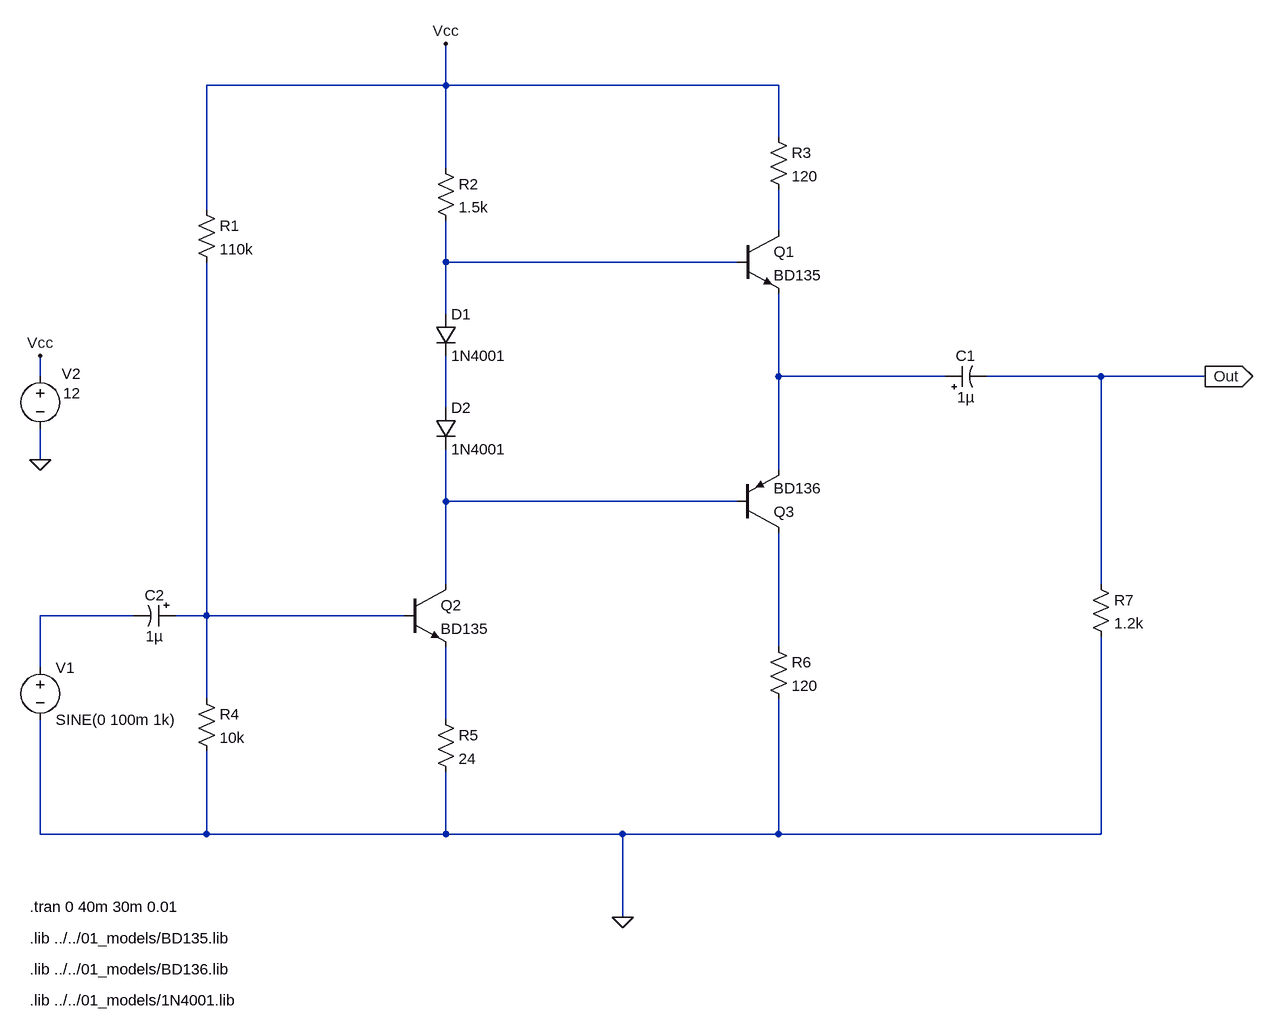
[diagram p0: schematic powamp_06_02_03_class_ab.asc]
powamp_06_02_03_class_ab.asc, the LTspice schematic file:
Version 4
SHEET 1 1580 1208
WIRE 288 -288 288 -352
WIRE 288 -288 -80 -288
WIRE 800 -288 288 -288
WIRE 800 -208 800 -288
WIRE 288 -160 288 -288
WIRE -80 -96 -80 -288
WIRE 800 -64 800 -128
WIRE 288 -16 288 -80
WIRE 736 -16 288 -16
WIRE 288 64 288 -16
WIRE -336 160 -336 128
WIRE 800 160 800 32
WIRE 1056 160 800 160
WIRE 1296 160 1120 160
WIRE 1456 160 1296 160
WIRE 288 208 288 128
WIRE -336 288 -336 240
WIRE 800 304 800 160
WIRE 288 352 288 272
WIRE 736 352 288 352
WIRE 288 480 288 352
WIRE 1296 480 1296 160
WIRE -192 528 -336 528
WIRE -80 528 -80 -16
WIRE -80 528 -128 528
WIRE 224 528 -80 528
WIRE 800 576 800 400
WIRE -336 608 -336 528
WIRE -80 656 -80 528
WIRE 288 688 288 576
WIRE -336 864 -336 688
WIRE -80 864 -80 736
WIRE -80 864 -336 864
WIRE 288 864 288 768
WIRE 288 864 -80 864
WIRE 560 864 288 864
WIRE 800 864 800 656
WIRE 800 864 560 864
WIRE 1296 864 1296 560
WIRE 1296 864 800 864
WIRE 560 992 560 864
FLAG 560 992 0
FLAG 1456 160 Out
IOPIN 1456 160 Out
FLAG -336 288 0
FLAG -336 128 Vcc
FLAG 288 -352 Vcc
SYMBOL res -96 -112 R0
SYMATTR InstName R1
SYMATTR Value 110k
SYMBOL res 272 -176 R0
SYMATTR InstName R2
SYMATTR Value 1.5k
SYMBOL res 784 -224 R0
SYMATTR InstName R3
SYMATTR Value 120
SYMBOL res -96 640 R0
SYMATTR InstName R4
SYMATTR Value 10k
SYMBOL res 272 672 R0
SYMATTR InstName R5
SYMATTR Value 24
SYMBOL res 784 560 R0
SYMATTR InstName R6
SYMATTR Value 120
SYMBOL res 1280 464 R0
SYMATTR InstName R7
SYMATTR Value 1.2k
SYMBOL polcap 1056 176 R270
WINDOW 0 32 32 VTop 2
WINDOW 3 0 32 VBottom 2
SYMATTR InstName C1
SYMATTR Value 1µ
SYMBOL polcap -128 512 R90
WINDOW 0 0 32 VBottom 2
WINDOW 3 32 32 VTop 2
SYMATTR InstName C2
SYMATTR Value 1µ
SYMBOL voltage -336 592 R0
WINDOW 123 0 0 Left 2
WINDOW 39 0 0 Left 2
SYMATTR InstName V1
SYMATTR Value SINE(0 100m 1k)
SYMBOL voltage -336 144 R0
WINDOW 3 35 42 Left 2
WINDOW 123 0 0 Left 2
WINDOW 39 0 0 Left 2
WINDOW 0 33 12 Left 2
SYMATTR Value 12
SYMATTR InstName V2
SYMBOL npn2 736 -64 R0
SYMATTR InstName Q1
SYMATTR Value BD135
SYMBOL npn2 224 480 R0
SYMATTR InstName Q2
SYMATTR Value BD135
SYMBOL pnp2 736 400 M180
SYMATTR InstName Q3
SYMATTR Value BD136
SYMBOL diode 272 64 R0
SYMATTR InstName D1
SYMATTR Value 1N4001
SYMBOL diode 272 208 R0
SYMATTR InstName D2
SYMATTR Value 1N4001
TEXT -352 976 Left 2 !.tran 0 40m 30m 0.01
TEXT -352 1024 Left 2 !.lib ../../01_models/BD135.lib
TEXT -352 1072 Left 2 !.lib ../../01_models/BD136.lib
TEXT -352 1120 Left 2 !.lib ../../01_models/1N4001.lib

The netlist it stands for:
* powamp_06_02_03_class_ab.asc
R1 Vcc N007 110k
R2 Vcc N002 1.5k
R3 Vcc N001 120
R4 N007 0 10k
R5 N009 0 24
R6 N008 0 120
R7 Out 0 1.2k
C1 N003 Out 1µ
C2 N007 N006 1µ
V1 N006 0 SINE(0 100m 1k)
V2 Vcc 0 12
Q1 N001 N002 N003 0 BD135
Q2 N005 N007 N009 0 BD135
Q3 N008 N005 N003 0 BD136
D1 N002 N004 1N4001
D2 N004 N005 1N4001
.model D D
.lib standard.dio
.model NPN NPN
.model PNP PNP
.lib standard.bjt
.tran 0 40m 30m 0.01
.lib ../../01_models/BD135.lib
.lib ../../01_models/BD136.lib
.lib ../../01_models/1N4001.lib
.backanno
.end